# EAGLE design AnalogPairCommon (EAGLE 8.5.2)
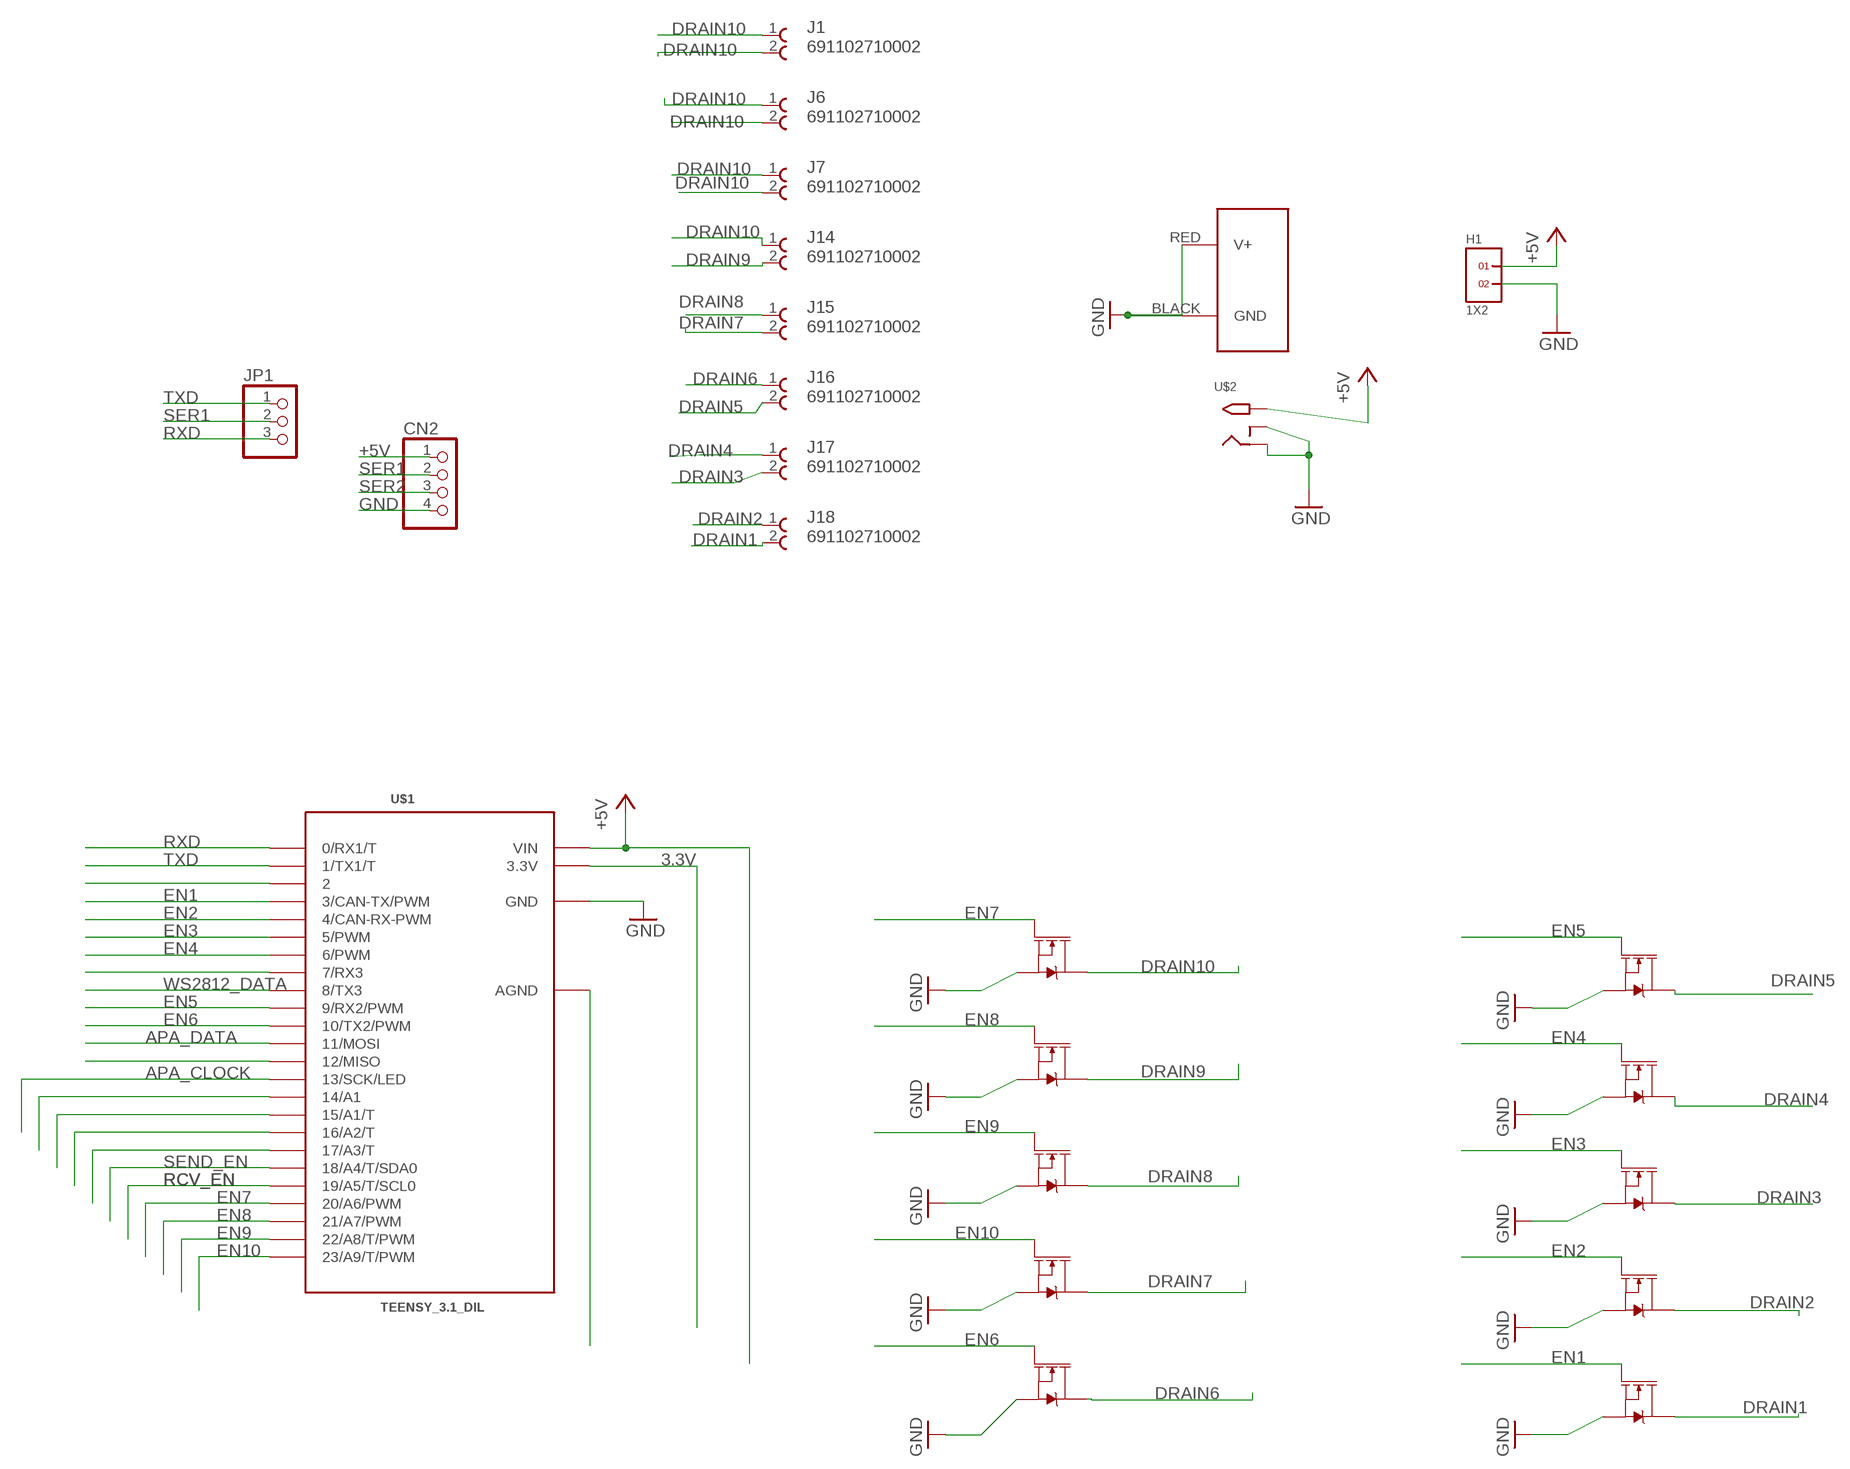
[diagram p0: schematic, sheet 1]

## Parts
CN2  HEADER-1X4  [1X04_OVAL]
H1  1X2  [1X2]
J1  691102710002  [691102710002]
J2  POWERPOLE_POWER25A  [POWERPOLE_PAIR_25A]
J6  691102710002  [691102710002]
J7  691102710002  [691102710002]
J14  691102710002  [691102710002]
J15  691102710002  [691102710002]
J16  691102710002  [691102710002]
J17  691102710002  [691102710002]
J18  691102710002  [691102710002]
JP1  PINHD-1X3  [1X03]
Q1  35A/25V/8.5mΩ  MOSFET-NCH-FDD8780  [DPAK]
Q2  35A/25V/8.5mΩ  MOSFET-NCH-FDD8780  [DPAK]
Q3  35A/25V/8.5mΩ  MOSFET-NCH-FDD8780  [DPAK]
Q4  35A/25V/8.5mΩ  MOSFET-NCH-FDD8780  [DPAK]
Q5  35A/25V/8.5mΩ  MOSFET-NCH-FDD8780  [DPAK]
Q6  35A/25V/8.5mΩ  MOSFET-NCH-FDD8780  [DPAK]
Q7  35A/25V/8.5mΩ  MOSFET-NCH-FDD8780  [DPAK]
Q8  35A/25V/8.5mΩ  MOSFET-NCH-FDD8780  [DPAK]
Q9  35A/25V/8.5mΩ  MOSFET-NCH-FDD8780  [DPAK]
Q10  35A/25V/8.5mΩ  MOSFET-NCH-FDD8780  [DPAK]
U$1  TEENSY_3.1_DIL  [TEENSY3-DIL]
U$2  2.1MMJACKTHM  [PJ-102A]

## Nets
3.3V: U$1.3.3V
+5V: CN2.1 H1.1 U$1.VIN U$2.TIP
APA_CLOCK: U$1.13(13/SCK/LED)
APA_DATA: U$1.11(11/MOSI)
DRAIN1: J18.2 Q10.4(D)
DRAIN2: J18.1 Q9.4(D)
DRAIN3: J17.2 Q8.4(D)
DRAIN4: J17.1 Q7.4(D)
DRAIN5: J16.2 Q4.4(D)
DRAIN6: J16.1 Q2.4(D)
DRAIN7: J15.2 Q6.4(D)
DRAIN8: J15.1 Q5.4(D)
DRAIN9: J14.2 Q3.4(D)
DRAIN10: J1.1 J1.2 J6.1 J6.2 J7.1 J7.2 J14.1 Q1.4(D)
EN1: Q10.1(G) U$1.3(3/CAN-TX/PWM)
EN2: Q9.1(G) U$1.4(4/CAN-RX-PWM)
EN3: Q8.1(G) U$1.5(5/PWM)
EN4: Q7.1(G) U$1.6(6/PWM)
EN5: Q4.1(G) U$1.9(9/RX2/PWM)
EN6: Q2.1(G) U$1.10(10/TX2/PWM)
EN7: Q1.1(G) U$1.20/A6(20/A6/PWM)
EN8: Q3.1(G) U$1.21/A7(21/A7/PWM)
EN9: Q5.1(G) U$1.22/A8(22/A8/T/PWM)
EN10: Q6.1(G) U$1.23/A9(23/A9/T/PWM)
GND: CN2.4 H1.2 J2.BLACK(GND) J2.RED(V+) Q1.3(S) Q2.3(S) Q3.3(S) Q4.3(S) Q5.3(S) Q6.3(S) Q7.3(S) Q8.3(S) Q9.3(S) Q10.3(S) U$1.GND U$2.RING U$2.RING_SW
N$6: U$1.2
N$7: U$1.7(7/RX3)
N$10: U$1.12(12/MISO)
N$12: U$1.14/A0(14/A1)
N$13: U$1.15/A1(15/A1/T)
N$14: U$1.16/A2(16/A2/T)
N$15: U$1.17/A3(17/A3/T)
N$18: U$1.AGND
RCV_EN: U$1.19/A5(19/A5/T/SCL0)
RXD: JP1.3 U$1.0(0/RX1/T)
SEND_EN: U$1.18/A4(18/A4/T/SDA0)
SER1: CN2.2 JP1.2
SER2: CN2.3
TXD: JP1.1 U$1.1(1/TX1/T)
WS2812_DATA: U$1.8(8/TX3)

## Library data of the parts
CN2 = microbuilder:HEADER-1X4: PIN HEADER
H1 = headers(.1in):1X2
J1 J6 J7 J14-J18 = 5mm Terminal Block:691102710002: ConTBL SERIE 102 - 5.0MM HORIZONTAL ENTRY WITH PRESSURE CLAMP - 1.5MM² WIRES WR-TBL, 2 Pins=>Code : Con_TBL_Screw_PressureClamp_691102710002 <http://katalog.we-online.de/media/images/eican/Con_TBL_Screw_PressureClamp_6911027100xx_pf2.jpg> Details see: http://katalog.we-online.de/en/em/691_102_710_0xx Created 2014-06-17, Karrer Zheng 2014 (C) Würth Elektronik; AVAILABILITY: Warning; DESCRIPTION: TERM BLK 5MM HORZ ENTRY MOD 2POS; MF: Wurth Electronics; MP: 691102710002; PACKAGE: None; PRICE: 0.69 USD
J2 = powerpoles:POWERPOLE_POWER: Anderson Powerpole Power Connector using ameteur radio standard layout
JP1 = adafruit:PINHD-1X3: PIN HEADER
Q1-Q10 = SparkFun-DiscreteSemi:MOSFET-NCH: N-channel MOSFETs Voltage controlled devices that allow control of high current outputs. SparkFun Products: SparkFun OpenScale <https://www.sparkfun.com/products/13261> SparkFun Digital Sandbox <https://www.sparkfun.com/products/12651> SparkFun Monster Moto Shield <https://www.sparkfun.com/products/10182> SparkFun MOSFET Power Controller <https://www.sparkfun.com/products/11214>; PROD_ID: TRANS-09984
U$1 = Teensy_3_and_LC_Series_Boards_v1.0:TEENSY_3.1_DIL: Teensy 3.1 or 3.2 in a DIL Layout.
U$2 = adafruit:2.1MMJACK: 2.1mm x 5.5mm THM DC jack with internal switch. Digikey part #PJ-102A, 4UCON part #05537 2.1mm x 5.5mm SMT DC jack with internal switch. Digikey part #PJ-002A-SMT, 4UCON part #03267 By microbuilder.eu & adafruit.com

## Board
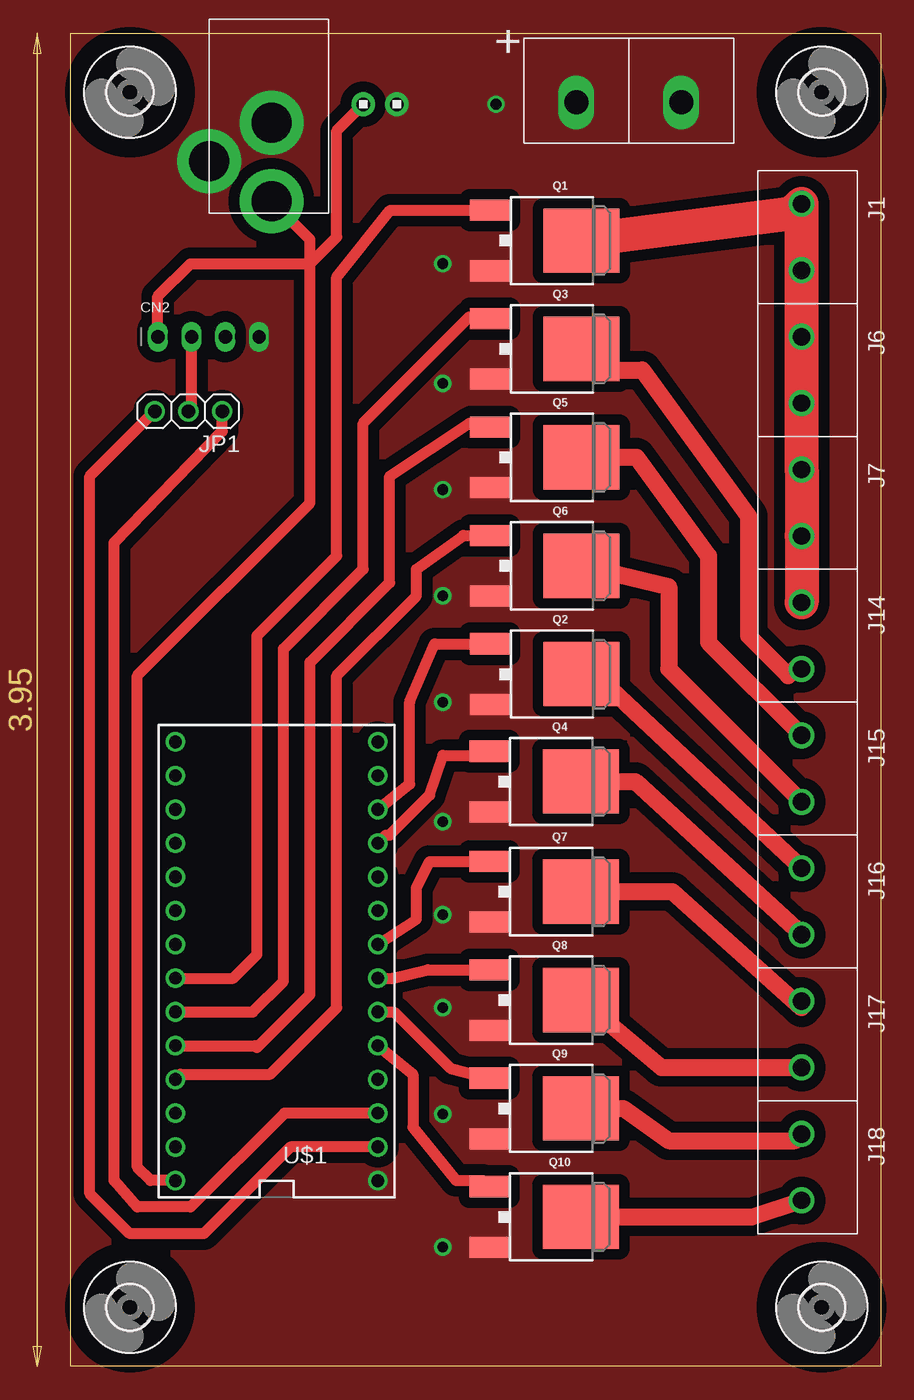
[diagram p1: board, top side]
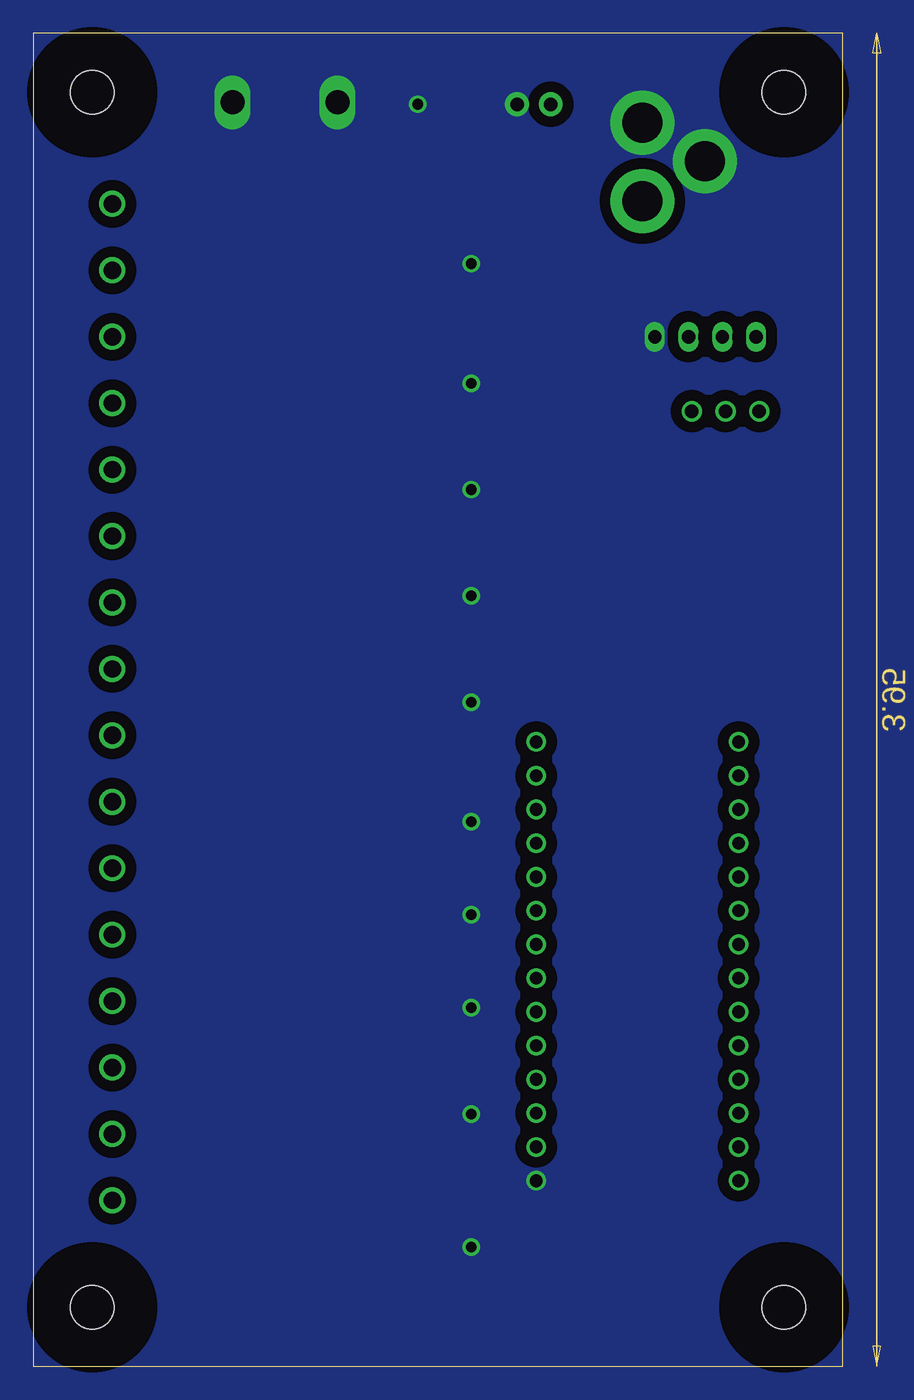
[diagram p2: board, bottom side, seen from below]

Size 60.96 x 100.33 mm. Coordinates in mm from the lower left corner, seen from the top.
Outline: 60.96,100.33 60.96,0 0,0 0,100.33 60.96,100.33
Copper layers (1*16): Top 0.035mm / dielectric 1.5mm / Bottom 0.035mm
Design rules "OthermillDRC_1_32_v2": minimum track width 8mil, minimum drill 0.8mm, track to track 0.794003125mm, track to pad 0.794003125mm, pad to pad 0.794003125mm, via to via 0.794003125mm, smd to smd 0mil, copper to edge 0mil, drill to drill 1mil, minimum pad ring 10mil, minimum via ring 10mil, stop-mask expansion 1mil, vias tented up to drill 30mil, thermal gap 10mil

### Footprints (pad centres in the part's own frame; a part is rotated, then mirrored left to right if it is on the bottom)
1X04_OVAL = drill 1 long: 1 -3.81,0; 2 -1.27,0; 3 1.27,0; 4 3.81,0
1X2 = drill 1.016 pad 1.778: 1 0,0; 2 2.54,0
691102710002 = drill 1.3: 1 -2.5,0; 2 2.5,0
POWERPOLE_PAIR_25A = drill 1.8 long: BLACK 3.95,-0.85; RED -3.95,-0.85
1X03 = drill 1.016: 1 -2.54,0; 2 0,0; 3 2.54,0
DPAK = smd 1.6 x 3: 1 -2.28,-5.31; 3 2.28,-5.31 | smd 4.826 x 5.715: 4 0,1.588
TEENSY3-DIL = drill 0.965: 0 -7.62,13.97; 1 -7.62,11.43; 2 -7.62,8.89; 3 -7.62,6.35; 3.3V 7.62,11.43; 4 -7.62,3.81; 5 -7.62,1.27; 6 -7.62,-1.27; 7 -7.62,-3.81; 8 -7.62,-6.35; 9 -7.62,-8.89; 10 -7.62,-11.43; 11 -7.62,-13.97; 12 -7.62,-16.51; 13 7.62,-16.51; 14/A0 7.62,-13.97; 15/A1 7.62,-11.43; 16/A2 7.62,-8.89; 17/A3 7.62,-6.35; 18/A4 7.62,-3.81; 19/A5 7.62,-1.27; 20/A6 7.62,1.27; 21/A7 7.62,3.81; 22/A8 7.62,6.35; 23/A9 7.62,8.89; AGND 7.62,13.97; GND -7.62,16.51; VIN 7.62,16.51
PJ-102A = drill 3 pad 4.8: RING 0.1,-3.39; RING_SW -4.6,-6.29; TIP 0.1,-9.29
3,3 = hole 3.3: 0,0

### Placement (x,y rotation side)
CN2  10.35,77.48 0 top
H1  22,94.98 0 top
J1  55,84.98 270 top
J2  42,95.98 0 top
J6  55,74.98 270 top
J7  55,64.98 270 top
J14  55,54.98 270 top
J15  55,44.98 270 top
J16  55,34.98 270 top
J17  55,24.98 270 top
J18  55,14.98 270 top
JP1  8.85,71.88 180 top
Q1  36.84,84.73 270 top
Q2  36.84,52.09 270 top
Q3  36.84,76.57 270 top
Q4  36.8,44.01 270 top
Q5  36.84,68.41 270 top
Q6  36.84,60.25 270 top
Q7  36.8,35.72 270 top
Q8  36.8,27.56 270 top
Q9  36.8,19.4 270 top
Q10  36.8,11.24 270 top
U$1  15.48,30.48 180 top
U$2  15,96.98 0 top
U$11  [3,3]  4.45,95.89 0 top
U$15  [3,3]  56.52,95.89 0 top
U$16  [3,3]  4.45,4.45 0 top
U$19  [3,3]  56.52,4.45 0 top

### Tracks (layer width: path | path; a pad name or v marks a point on that pad's centre or on a via)
+5V
  Top 0.813: U$1.VIN 7.84,13.98 6,13.98 5,14.98 5,51.98 18,64.98 18,82.98 | 18,82.98 18,84.8 U$2.TIP | CN2.1 6.54,80.53 9,82.98 18,82.98 | 18,82.98 20,84.98 20,92.98 H1.1
DRAIN1
  Top 1.27: Q10.4 51.24,11.24 J18.2
DRAIN2
  Top 1.27: Q9.4 41.59,19.4 45,16.98 54.5,16.98 J18.1
DRAIN3
  Top 1.27: Q8.4 44.46,22.48 J17.2
DRAIN4
  Top 1.27: Q7.4 45.27,35.72 55,26.98 J17.1
DRAIN5
  Top 1.27: Q4.4 42.48,44.01 J16.2
DRAIN6
  Top 1.27: Q2.4 39.4,52.09 J16.1
DRAIN7
  Top 1.27: Q6.4 45,58.67 45,52.48 J15.2
DRAIN8
  Top 1.27: Q5.4 42.58,68.41 48,60.98 48,54.48 J15.1
DRAIN9
  Top 1.27: Q3.4 40.01,74.98 43,74.98 51,63.98 51,54.98 54,51.98 54.5,52.48 J14.2
DRAIN10
  Top 2.54: Q1.4 54.24,86.73 J1.1 J1.2 J6.1 J6.2 J7.1 J7.2 J14.1
EN1
  Top 0.813: U$1.3 25.75,21.98 25.75,17.98 29,13.98 31.02,13.98 Q10.1
EN2
  Top 0.813: U$1.4 24.32,26.67 28.55,22.43 Q9.1
EN3
  Top 0.813: U$1.5 24.23,29.21 26.86,29.84 Q8.1
EN4
  Top 0.813: U$1.6 26,33.65 26,35.98 27,37.98 31.47,37.98 Q7.1
EN5
  Top 0.813: U$1.9 23.71,39.98 24,39.98 27,42.98 28,45.98 31.18,45.98 Q4.1
EN6
  Top 0.813: U$1.10 25.5,43.81 25.5,49.98 27.39,54.37 Q2.1
EN7
  Top 0.813: U$1.20/A6 12.22,29.21 14,30.98 14,54.98 20,60.98 20,81.98 24.02,87.01 Q1.1
EN8
  Top 0.813: U$1.21/A7 13.69,26.67 16,28.98 16,53.98 22,59.98 22,70.98 30,78.98 30.14,78.85 Q3.1
EN9
  Top 0.813: U$1.22/A8 13.86,24.13 14,23.98 18,27.98 18,52.98 24,58.98 24,66.98 30,70.98 31.23,70.98 Q5.1
EN10
  Top 0.813: U$1.23/A9 8.26,21.98 15,21.98 20,26.98 20,51.98 26,57.98 26,59.98 29.55,62.53 Q6.1
GND  (via drill 0.8)
  other vias: 28,82.98 28,73.98 28,65.98 28,57.98 28,49.98 28,40.98 28,33.98 28,26.98 28,18.98 28,8.98 32,94.98
  pour Bottom (isolate 0.813, rank 2, no thermals): -12.7,119.38 82.55,119.38 82.55,-13.97 -12.7,-13.97
  pour Top (isolate 0.813, no thermals): -12.7,119.38 82.55,119.38 82.55,-13.97 -12.7,-13.97
RXD
  Top 0.813: U$1.0 16.52,16.51 10,9.98 4.42,9.98 1.42,12.98 1.42,67 JP1.3
SER1
  Top 0.813: CN2.2 9.08,72.12 JP1.2
TXD
  Top 0.813: U$1.1 16.07,19.05 9,11.98 5,11.98 3.25,13.98 3.25,61.98 11.38,70.37 JP1.1

### Text on the board
tPlace: PWM1 | PWM2 | PWM3 | PWM4 | PWM5 | PWM6 | PWM7 | PWM8 | PWM9 | PWM10
tNames: Direct | Direct | Direct
tSilk: Direct | Direct | Direct